# Altium schematic sheet STMod+.SchDoc: STMod+
size A4; CompanyName: STMicroelectronics; Organization: Microcontrollers Division; DocumentNumber: 17; SheetNumber: 14; SheetTotal: 19
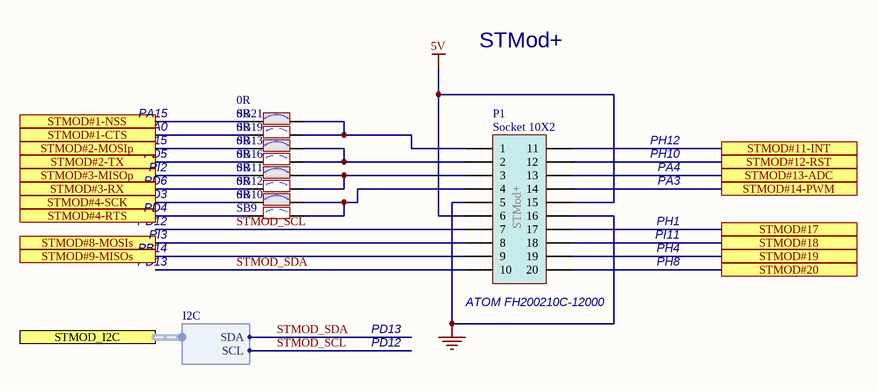
[diagram p0: STMod+.SchDoc]

## Parts
P1  value Socket 10X2  [CON_SAMTEC_SQT-110-01-F-D-RA__STMOD+]  (hidden comment: Socket 10X2 STMod+)
SB9  value 0R  [SOLDER-BRIDGE_R0603-0R]  (hidden comment: SB_OFF)
SB10  value 0R  [SOLDER-BRIDGE_R0603-0R]  (hidden comment: SB_ON)
SB11  value 0R  [SOLDER-BRIDGE_R0603-0R]  (hidden comment: SB_ON)
SB12  value 0R  [SOLDER-BRIDGE_R0603-0R]  (hidden comment: SB_OFF)
SB13  value 0R  [SOLDER-BRIDGE_R0603-0R]  (hidden comment: SB_ON)
SB16  value 0R  [SOLDER-BRIDGE_R0603-0R]  (hidden comment: SB_OFF)
SB19  value 0R  [SOLDER-BRIDGE_R0603-0R]  (hidden comment: SB_OFF)
SB21  value 0R  [SOLDER-BRIDGE_R0603-0R]  (hidden comment: SB_ON)

## Ports
STMOD#1-CTS, STMOD#1-NSS, STMOD#2-MOSIp, STMOD#2-TX, STMOD#3-MISOp, STMOD#3-RX, STMOD#4-RTS, STMOD#4-SCK, STMOD#8-MOSIs, STMOD#9-MISOs, STMOD#11-INT, STMOD#12-RST, STMOD#13-ADC, STMOD#14-PWM, STMOD#17, STMOD#18, STMOD#19, STMOD#20, STMOD_I2C (harness I2C)

## Harnesses
I2C: SDA, SCL

## Nets
5V: P1.6 P1.15
GND: P1.5 P1.16
STMOD#1-CTS: SB19.1 ; port STMOD#1-CTS
STMOD#1-NSS: SB21.1 ; port STMOD#1-NSS
STMOD#2-MOSIp: SB13.1 ; port STMOD#2-MOSIp
STMOD#2-TX: SB16.1 ; port STMOD#2-TX
STMOD#3-MISOp: SB11.1 ; port STMOD#3-MISOp
STMOD#3-RX: SB12.1 ; port STMOD#3-RX
STMOD#4-RTS: SB9.1 ; port STMOD#4-RTS
STMOD#4-SCK: SB10.1 ; port STMOD#4-SCK
STMOD#8-MOSIs: P1.8 ; port STMOD#8-MOSIs
STMOD#9-MISOs: P1.9 ; port STMOD#9-MISOs
STMOD#11-INT: P1.11 ; port STMOD#11-INT
STMOD#12-RST: P1.12 ; port STMOD#12-RST
STMOD#13-ADC: P1.13 ; port STMOD#13-ADC
STMOD#14-PWM: P1.14 ; port STMOD#14-PWM
STMOD#17: P1.17 ; port STMOD#17
STMOD#18: P1.18 ; port STMOD#18
STMOD#19: P1.19 ; port STMOD#19
STMOD#20: P1.20 ; port STMOD#20
STMOD_SCL: P1.7 ; port STMOD_I2C.SCL
STMOD_SDA: P1.10 ; port STMOD_I2C.SDA
NetP1_1: P1.1 SB19.2 SB21.2
NetP1_2: P1.2 SB13.2 SB16.2
NetP1_3: P1.3 SB11.2 SB12.2
NetP1_4: P1.4 SB9.2 SB10.2

## Notes on the sheet
- STMod+
- PA0
- PB15
- PA15
- PH12
- PD5
- PD6
- PI2
- PD3
- PD4
- PH10
- PA4
- PA3
- PD12
- PI3
- PB14
- PD13
- PI11
- PH1
- PH4
- PH8
- (near P1) ATOM FH200210C-12000
- Title:
- Project:
- Size:
- Revision:
- Variant:
- A4
- -
- Date:
- Reference:
- Sheet:
- of
- (in symbol MCD-00309) STMod+

## Library data of the parts
P1 = MCD-00309: Socket 10x2, 2.00mm, RA, TH, Height 6.35mm/2.29mm; Part_Type: Connector; Manufacturer_Part_Number: SQT-110-01-F-D-RA; Manufacturer: SAMTEC; Part_Preference: Recommended; Partial_Alternate_Internal_Part_Number: MCD-03873; Provided_By: SubCon; Initial_Board_Reference: MB1311; Component_Country_Of_Origin: China, Costa Rica, Malaysia, USA, Vietnam; ID: 2557; Order_Code_RS: 180-1541; ShowFields: YES; Internal_Part_Number: MCD-00309; Status: Released; ComponentLink1Description: Samtec_SQT-series.pdf; ComponentLink1URL: http://tunmcdsvn.tun.st.com/Component_Documentation_Library/Trunk/Connector/SAMTEC_SQT_Series; ECCN_US: n/a; ECCN_EU: n/a; Order_Code_Digikey: SAM10734-ND; Order_Code_Farnell: 2856563
SB9 SB12 SB16 SB19 = MCD-00072: Solder Bridge OFF; Part_Type: Resistor; Manufacturer: YAGEO; Manufacturer_HQ_COO: Unknown; Manufacturer_Part_Number: RC0603JR-070RL; Part_Preference: Recommended; Initial_Board_Reference: mb1274; Component_Country_Of_Origin: China; ID: 2520; Order_Code_RS: 199-5647; ShowFields: YES; Internal_Part_Number: MCD-00072; Status: Released; ECCN_US: n/a; ECCN_EU: n/a; Provided_By: n/a; ComponentLink1URL: http://tunmcdsvn.tun.st.com/Component_Documentation_Library/Trunk/Resistor/YAGEO_RC_Series; Order_Code_Digikey: 311-0.0GRTR-ND; Order_Code_Farnell: 2421846; Package: 0603
SB10 SB11 SB13 SB21 = MCD-00071: Solder Bridge ON; Part_Type: Resistor; Manufacturer: YAGEO; Manufacturer_HQ_COO: Unknown; Manufacturer_Part_Number: RC0603JR-070RL; Part_Preference: Recommended; Provided_By: Subcon; Initial_Board_Reference: mb1274; Component_Country_Of_Origin: China; ID: 2521; Order_Code_RS: 199-5647; ShowFields: YES; Internal_Part_Number: MCD-00071; ECCN_US: n/a; ECCN_EU: n/a; Status: Released; ComponentLink1URL: http://tunmcdsvn.tun.st.com/Component_Documentation_Library/Trunk/Resistor/YAGEO_RC_Series; Order_Code_Digikey: 311-0.0GRTR-ND; Order_Code_Farnell: 2421846; Package: 0603